# Altium schematic sheet VT.SchDoc
size A
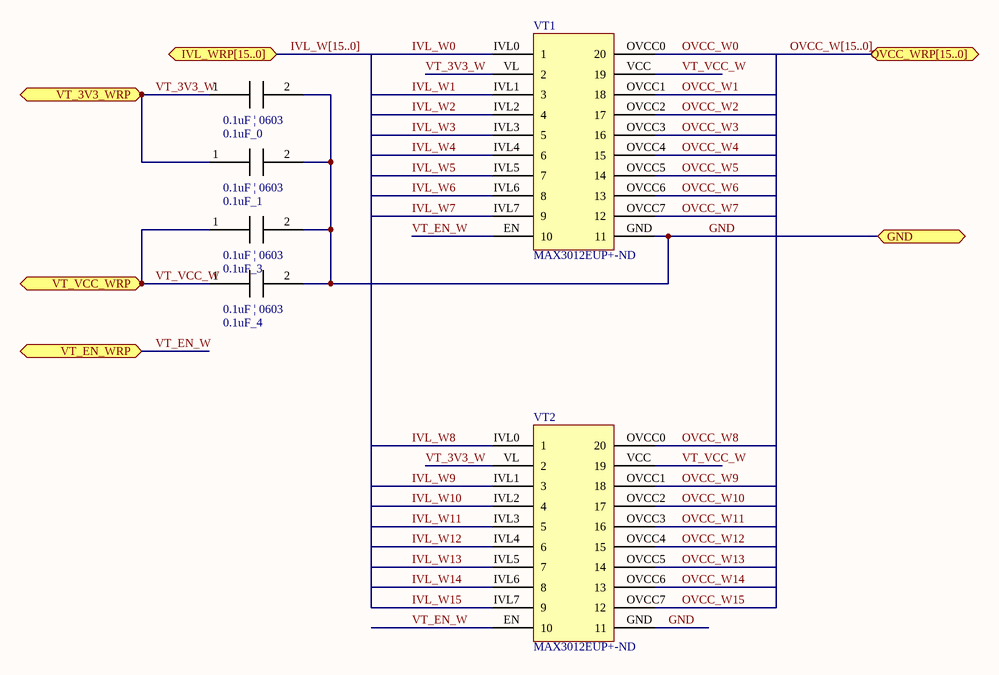
[diagram p0: VT.SchDoc]

## Parts
0.1uF_0  0.1uF_0603  [0.1uF_0603]  (value not drawn)
0.1uF_1  0.1uF_0603  [0.1uF_0603]  (value not drawn)
0.1uF_3  0.1uF_0603  [0.1uF_0603]  (value not drawn)
0.1uF_4  0.1uF_0603  [0.1uF_0603]  (value not drawn)
VT1  Supplier Part Number 1: MAX3012EUP+-ND  [VT_TSSOP20]  (hidden comment: MAX3012EUP+)
VT2  Supplier Part Number 1: MAX3012EUP+-ND  [VT_TSSOP20]  (hidden comment: MAX3012EUP+)

## Ports
GND (bidir), IVL_WRP[15..0], OVCC_WRP[15..0], VT_3V3_WRP, VT_EN_WRP, VT_VCC_WRP

## Nets
GND: VT1.GND(11) VT2.GND(11) ; port GND
IVL_W0: VT1.IVL0(1)
IVL_W1: VT1.IVL1(3)
IVL_W2: VT1.IVL2(4)
IVL_W3: VT1.IVL3(5)
IVL_W4: VT1.IVL4(6)
IVL_W5: VT1.IVL5(7)
IVL_W6: VT1.IVL6(8)
IVL_W7: VT1.IVL7(9)
IVL_W8: VT2.IVL0(1)
IVL_W9: VT2.IVL1(3)
IVL_W10: VT2.IVL2(4)
IVL_W11: VT2.IVL3(5)
IVL_W12: VT2.IVL4(6)
IVL_W13: VT2.IVL5(7)
IVL_W14: VT2.IVL6(8)
IVL_W15: VT2.IVL7(9)
OVCC_W0: VT1.OVCC0(20)
OVCC_W1: VT1.OVCC1(18)
OVCC_W2: VT1.OVCC2(17)
OVCC_W3: VT1.OVCC3(16)
OVCC_W4: VT1.OVCC4(15)
OVCC_W5: VT1.OVCC5(14)
OVCC_W6: VT1.OVCC6(13)
OVCC_W7: VT1.OVCC7(12)
OVCC_W8: VT2.OVCC0(20)
OVCC_W9: VT2.OVCC1(18)
OVCC_W10: VT2.OVCC2(17)
OVCC_W11: VT2.OVCC3(16)
OVCC_W12: VT2.OVCC4(15)
OVCC_W13: VT2.OVCC5(14)
OVCC_W14: VT2.OVCC6(13)
OVCC_W15: VT2.OVCC7(12)
VT_3V3_W: 0.1uF_0.1 0.1uF_1.1 VT1.VL(2) VT2.VL(2) ; port VT_3V3_WRP
VT_EN_W: VT1.EN(10) VT2.EN(10) ; port VT_EN_WRP
VT_VCC_W: 0.1uF_3.1 0.1uF_4.1 VT1.VCC(19) VT2.VCC(19) ; port VT_VCC_WRP

Not connected (* = marked no-connect by the designer): 0.1uF_0 2; 0.1uF_1 2; 0.1uF_3 2; 0.1uF_4 2

## Buses and harness runs
bus IVL_W[15..0] = port IVL_WRP[15..0]
bus OVCC_W[15..0] = port OVCC_WRP[15..0]

## Notes on the sheet
- (in symbol 0.1uF_0603) 0.1uF | 0603

## Library data of the parts
VT1 VT2 = MAX3012EUP+: IC TRANSLATOR LEVEL 8CH 20-TSSOP; Manufacturer: Maxim Integrated; Translator Type: Voltage Level; Channel Type: Unidirectional; Number of Circuits: 1; Channels per Circuit: 8; Voltage - VCCA: 1.2 V ~ 5.5 V; Voltage - VCCB: 1.65 V ~ 5.5 V; Output Type: Tri-State, Non-Inverted; Data Rate: 35Mbps; Supplier 1: Digi-Key; Manufacturer Part Number: MAX3012EUP+; RoHS: RoHS Compliant; Category: Integrated Circuits (ICs); Stock 1: 297; Pricing 1: 1=3.17, 10=3.012, 25=2.81, 50=2.7668 (USD); Packaging: Tube; Input Signal: -; Output Signal: -; Operating Temperature: -40°C ~ 85°C (TA); Features: Power Supply Decoupling; Mounting Type: Surface Mount; Package / Case: 20-TSSOP (0.173", 4.40mm Width); Supplier Device Package: 20-TSSOP; ComponentLink1URL: http://datasheets.maximintegrated.com/en/ds/MAX3000E-MAX3012.pdf; ComponentLink1Description: http://datasheets.maximintegrated.com/en/ds/MAX3000E-MAX3012.pdf